# EAGLE schematic LDR_Schaltplan (EAGLE 8.1.0)
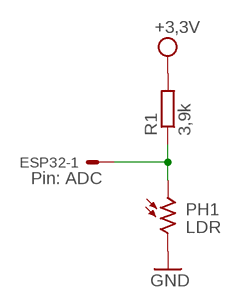
[diagram p0: schematic, sheet 1]

## Parts
ESP32  Pin: ADC  332-02  [332-02]
PH1  LDR  A1050_09  [T0-46-A10XX]
R1  3,9k  R-EU_0207/10  [0207/10]

## Nets
GND: PH1.2
N$1: ESP32.1 PH1.1 R1.1
VCC: R1.2 ; supply symbol labelled +3,3V
Unconnected: ESP32.2

## Library data of the parts
ESP32 = con-garry:332-02: 2 Pin - 2mm Dual Row Source: www.mpe-connector.de / garry_shortform_2012.pdf
PH1 = photo-elements:A10: Sensor Robust Light Sensing Applications Outdoor Light Sensing Application Source: http://optoelectronics.perkinelmer.com/content/Datasheets/DTS_PhotocellsA1050.pdf
R1 = rcl:R-EU_: RESISTOR, European symbol